# EAGLE schematic sidpi-revb (EAGLE 6.5.0)
.,m,.m,.m,.m,.m.,m
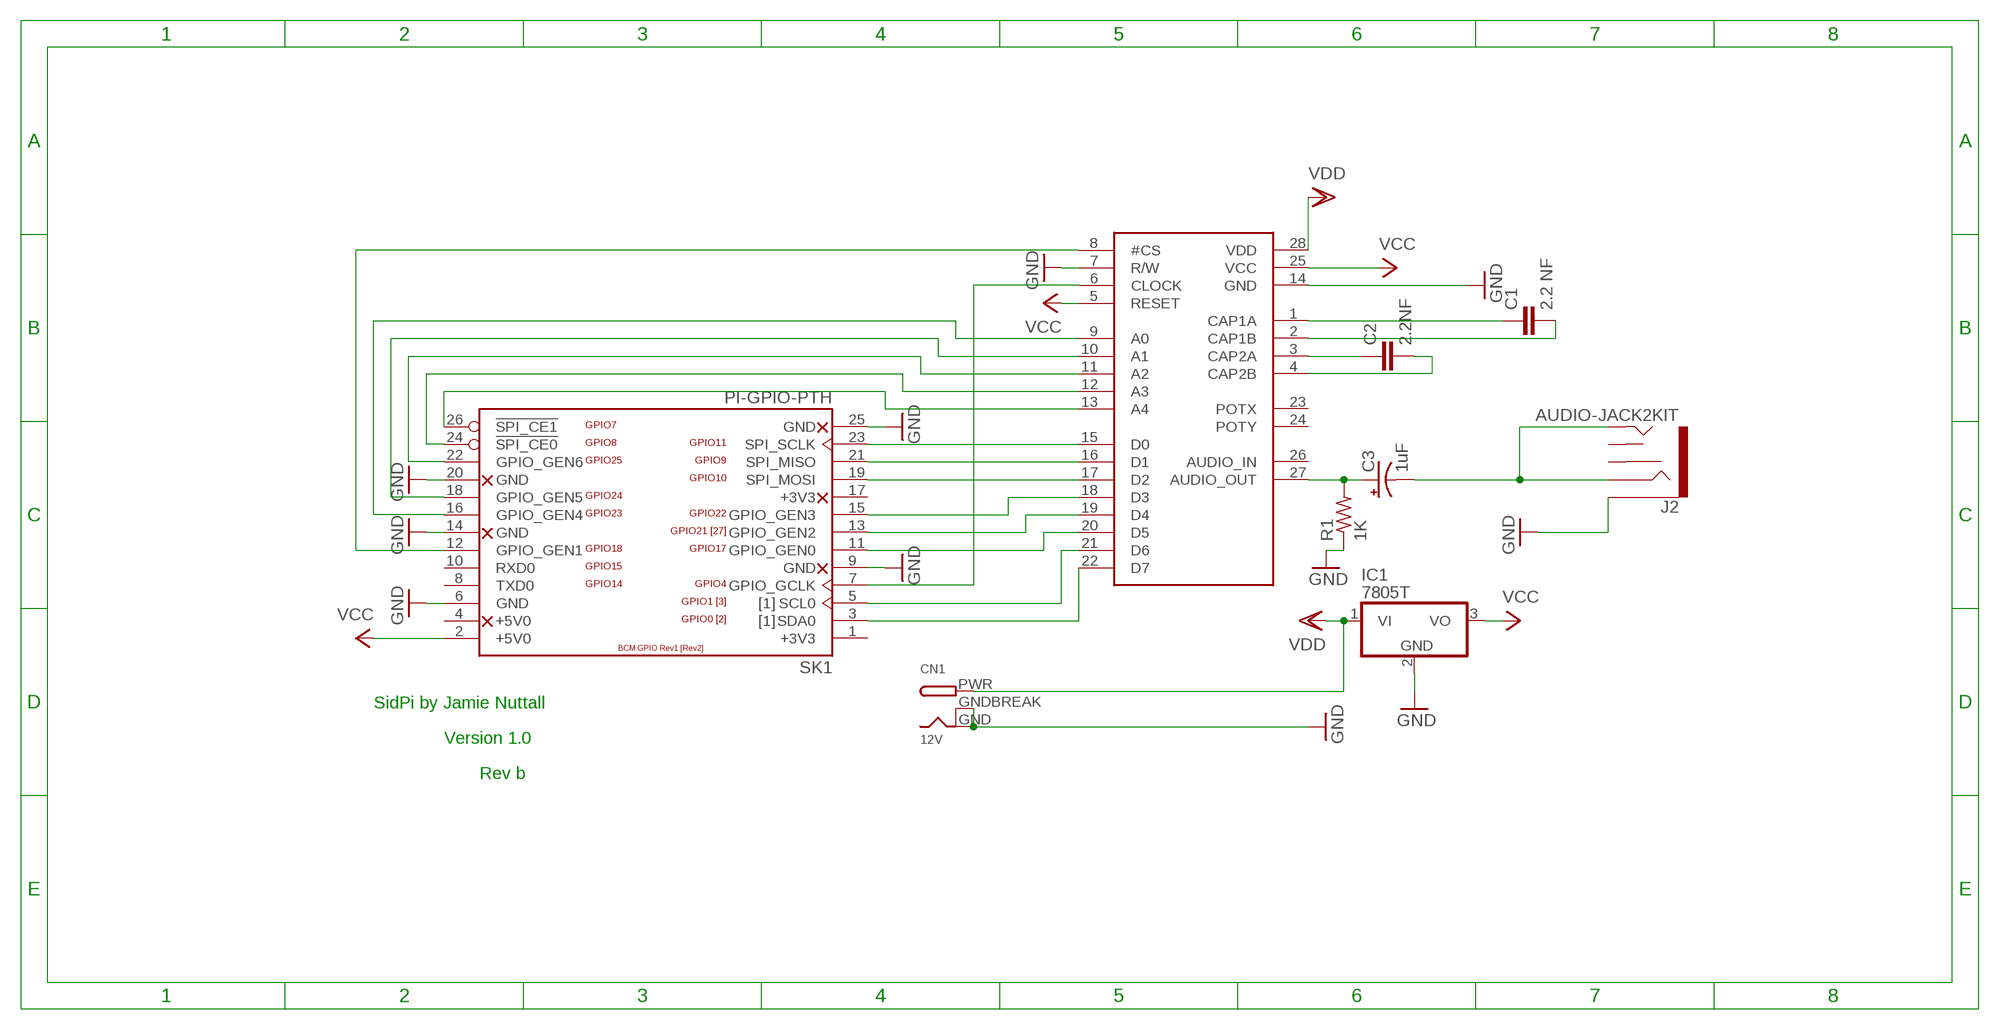
[diagram p0: schematic, sheet 1]

## Parts
C1  2.2 NF  CAPPTH2  [CAP-PTH-SMALL2]
C2  2.2NF  CAPPTH2  [CAP-PTH-SMALL2]
C3  1uF  CPOL-USE1.8-4  [E1,8-4]
CN1  12V  DCBARRELPTH  [DCJACK_2MM_PTH]
IC1  7805T  [TO220H]
J2  AUDIO-JACK2KIT  [AUDIO-JACK-KIT]
R1  1K  R-US_0309/10  [0309/10]
SK1  PI-GPIO-PTH  [GPIO-CONNECTOR]
U$1  6581  [DIL28-6]

## Nets
GND: CN1.GND CN1.GNDBREAK IC1.2(GND) J2.SLEEVE R1.1 SK1.6(GND) SK1.9(GND) SK1.14(GND) SK1.20(GND) SK1.25(GND) U$1.7(R/W) U$1.14(GND)
N$1: SK1.12(GPIO_GEN1) U$1.8(#CS)
N$2: SK1.24(!SPI_CE0) U$1.12(A3)
N$3: C1.1 U$1.1(CAP1A)
N$4: SK1.26(!SPI_CE1) U$1.13(A4)
N$5: SK1.3(SDA0) U$1.22(D7)
N$6: C2.1 U$1.3(CAP2A)
N$7: SK1.5(SCL0) U$1.21(D6)
N$8: C3.- J2.RING J2.TIP
N$9: SK1.7(GPIO_GCLK) U$1.6(CLOCK)
N$10: SK1.11(GPIO_GEN0) U$1.20(D5)
N$11: SK1.13(GPIO_GEN2) U$1.19(D4)
N$12: SK1.15(GPIO_GEN3) U$1.18(D3)
N$13: SK1.19(SPI_MOSI) U$1.17(D2)
N$14: SK1.21(SPI_MISO) U$1.16(D1)
N$15: C2.2 U$1.4(CAP2B)
N$17: C1.2 U$1.2(CAP1B)
N$19: SK1.23(SPI_SCLK) U$1.15(D0)
N$20: SK1.22(GPIO_GEN6) U$1.11(A2)
N$23: C3.+ R1.2 U$1.27(AUDIO_OUT)
N$24: SK1.16(GPIO_GEN4) U$1.9(A0)
N$25: SK1.18(GPIO_GEN5) U$1.10(A1)
VCC [VCC]: IC1.3(VO) SK1.2(+5V0) U$1.5(RESET) U$1.25(VCC)
VDD [VDD]: CN1.PWR IC1.1(VI) U$1.28(VDD)
Unconnected: J2.RSH J2.TSH SK1.4(+5V0) SK1.8(TXD0) SK1.10(RXD0) SK1.17(+3V3) U$1.23(POTX) U$1.24(POTY) U$1.26(AUDIO_IN)

## Notes on the sheet
- SidPi by Jamie Nuttall
- Version 1.0
- Rev b

## Power pins joined to a net without a drawn wire
+3V3: SK1.1(+3V3)

## Library data of the parts
C1 C2 = SparkFun-Capacitors:CAP: Capacitor Standard 0603 ceramic capacitor, and 0.1" leaded capacitor.
C3 = adafruit:CPOL-US: POLARIZED CAPACITOR, American symbol
CN1 = adafruit:DCBARREL: 2.0mm DC Barrel Jack DCJACK_2MM_PTH - Through Hole Jack (4UConnector: 05537)
IC1 = linear:78*: Positive VOLTAGE REGULATOR Source: http://cache.national.com/ds/LM/LM78L05.pdf http://www.fairchildsemi.com/ds/LM/LM7805.pdf; MF: ROHM; MPN: BA17805T; OC_FARNELL: 1831821
J2 = SparkFun-Connectors:AUDIO-JACK2: Stereo audio jack with bypass switches. SMT version used on LilyPad MP3 board.; PROD_ID: CONN-08774
R1 = adafruit:R-US_: RESISTOR, American symbol
SK1 = jt-raspberry-pi:PI-: Raspberry Pi; OC_FARNELL: unknown
U$1 = Mos6581_sid:6581: The Famous C64 Sound Chip - MOS6581; OC_FARNELL: unknown

## Net classes
0 default: width 0.5 mm, drill 0.4 mm, clearance 0.5 mm
1 VDD: width 1 mm, drill 0.4 mm, clearance 0.5 mm
2 VCC: width 1 mm, drill 0.4 mm, clearance 0.5 mm